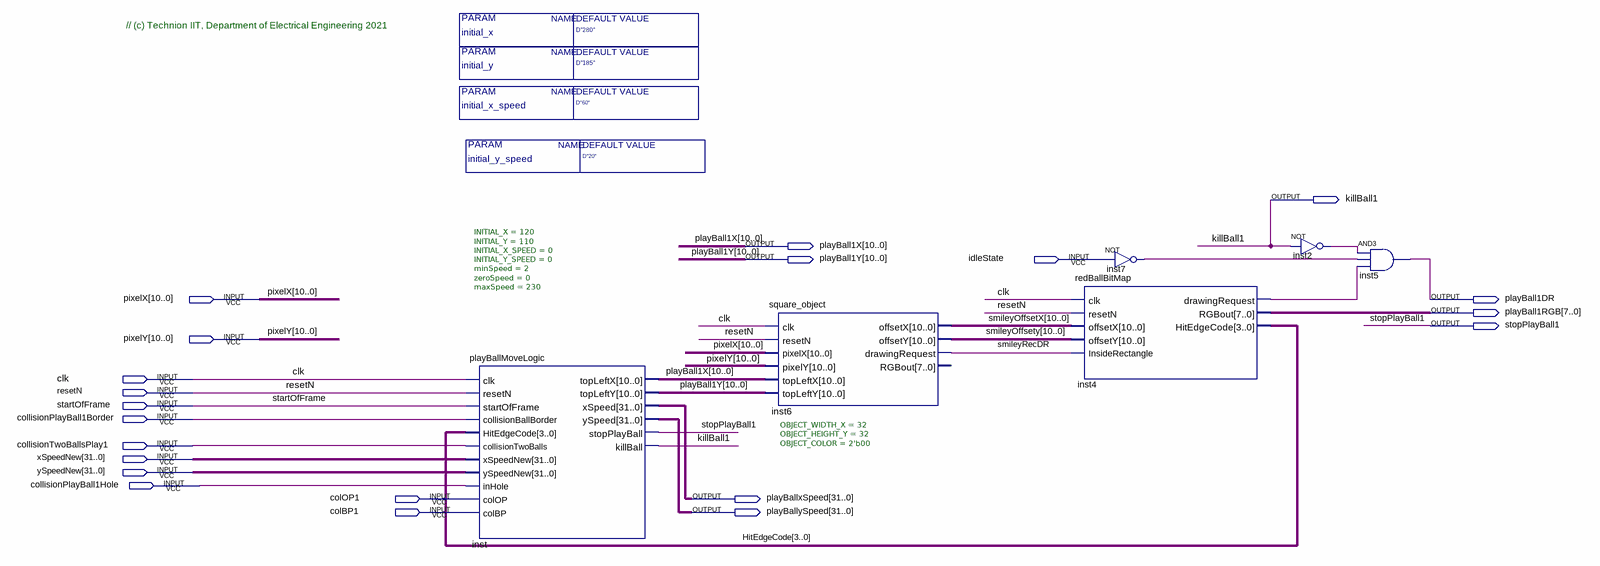
[diagram p0: schematic sheet]
// Quartus schematic playBall1Block.bdf as structural Verilog: 6 symbols, 21 pins
module playBall1Block #(parameter initial_x = "D\"280\"", parameter initial_y = "D\"185\"", parameter initial_x_speed = "D\"60\"", parameter initial_y_speed = "D\"20\"") (
  input  idleState,
  input  [10:0] pixelX,
  input  [10:0] pixelY,
  input  clk,
  input  resetN,
  input  startOfFrame,
  input  collisionPlayBall1Border,
  input  collisionTwoBallsPlay1,
  input  [31:0] xSpeedNew,
  input  [31:0] ySpeedNew,
  input  collisionPlayBall1Hole,
  input  colOP1,
  input  colBP1,
  output killBall1,
  output [10:0] playBall1X,
  output [10:0] playBall1Y,
  output playBall1DR,
  output [7:0] playBall1RGB,
  output stopPlayBall1,
  output [31:0] playBallxSpeed,
  output [31:0] playBallySpeed
);

  wire inst2_out, inst4_drawingrequest, inst7_out, smileyRecDR;
  wire [3:0] HitEdgeCode;
  wire [10:0] smileyOffsetX, smileyOffsety;

  playBallMoveLogic #(.INITIAL_X(120), .INITIAL_Y(110), .INITIAL_X_SPEED(0), .INITIAL_Y_SPEED(0), .minSpeed(2), .zeroSpeed(0), .maxSpeed(230)) inst (
    .clk(clk), .resetN(resetN), .startOfFrame(startOfFrame), .collisionBallBorder(collisionPlayBall1Border),
    .HitEdgeCode(HitEdgeCode), .collisionTwoBalls(collisionTwoBallsPlay1), .xSpeedNew(xSpeedNew),
    .ySpeedNew(ySpeedNew), .inHole(collisionPlayBall1Hole), .colOP(colOP1), .colBP(colBP1),
    .topLeftX(playBall1X), .topLeftY(playBall1Y), .xSpeed(playBallxSpeed), .ySpeed(playBallySpeed),
    .stopPlayBall(stopPlayBall1), .killBall(killBall1));
  square_object #(.OBJECT_WIDTH_X(32), .OBJECT_HEIGHT_Y(32), .OBJECT_COLOR(2'b00)) inst6 (
    .clk(clk), .resetN(resetN), .pixelX(pixelX), .pixelY(pixelY), .topLeftX(playBall1X),
    .topLeftY(playBall1Y), .offsetX(smileyOffsetX), .offsetY(smileyOffsety), .drawingRequest(smileyRecDR));  // open: RGBout
  redBallBitMap inst4 (
    .clk(clk), .resetN(resetN), .offsetX(smileyOffsetX), .offsetY(smileyOffsety),
    .InsideRectangle(smileyRecDR), .drawingRequest(inst4_drawingrequest), .RGBout(playBall1RGB),
    .HitEdgeCode(HitEdgeCode));
  not inst7 (inst7_out, idleState);
  not inst2 (inst2_out, killBall1);
  and inst5 (playBall1DR, inst2_out, inst7_out, inst4_drawingrequest);

  // Notes on the sheet:
  //   // (c) Technion IIT, Department of Electrical Engineering 2021
endmodule
